# EAGLE design 6540Adapter_v2.0_th (EAGLE 7.7.0)
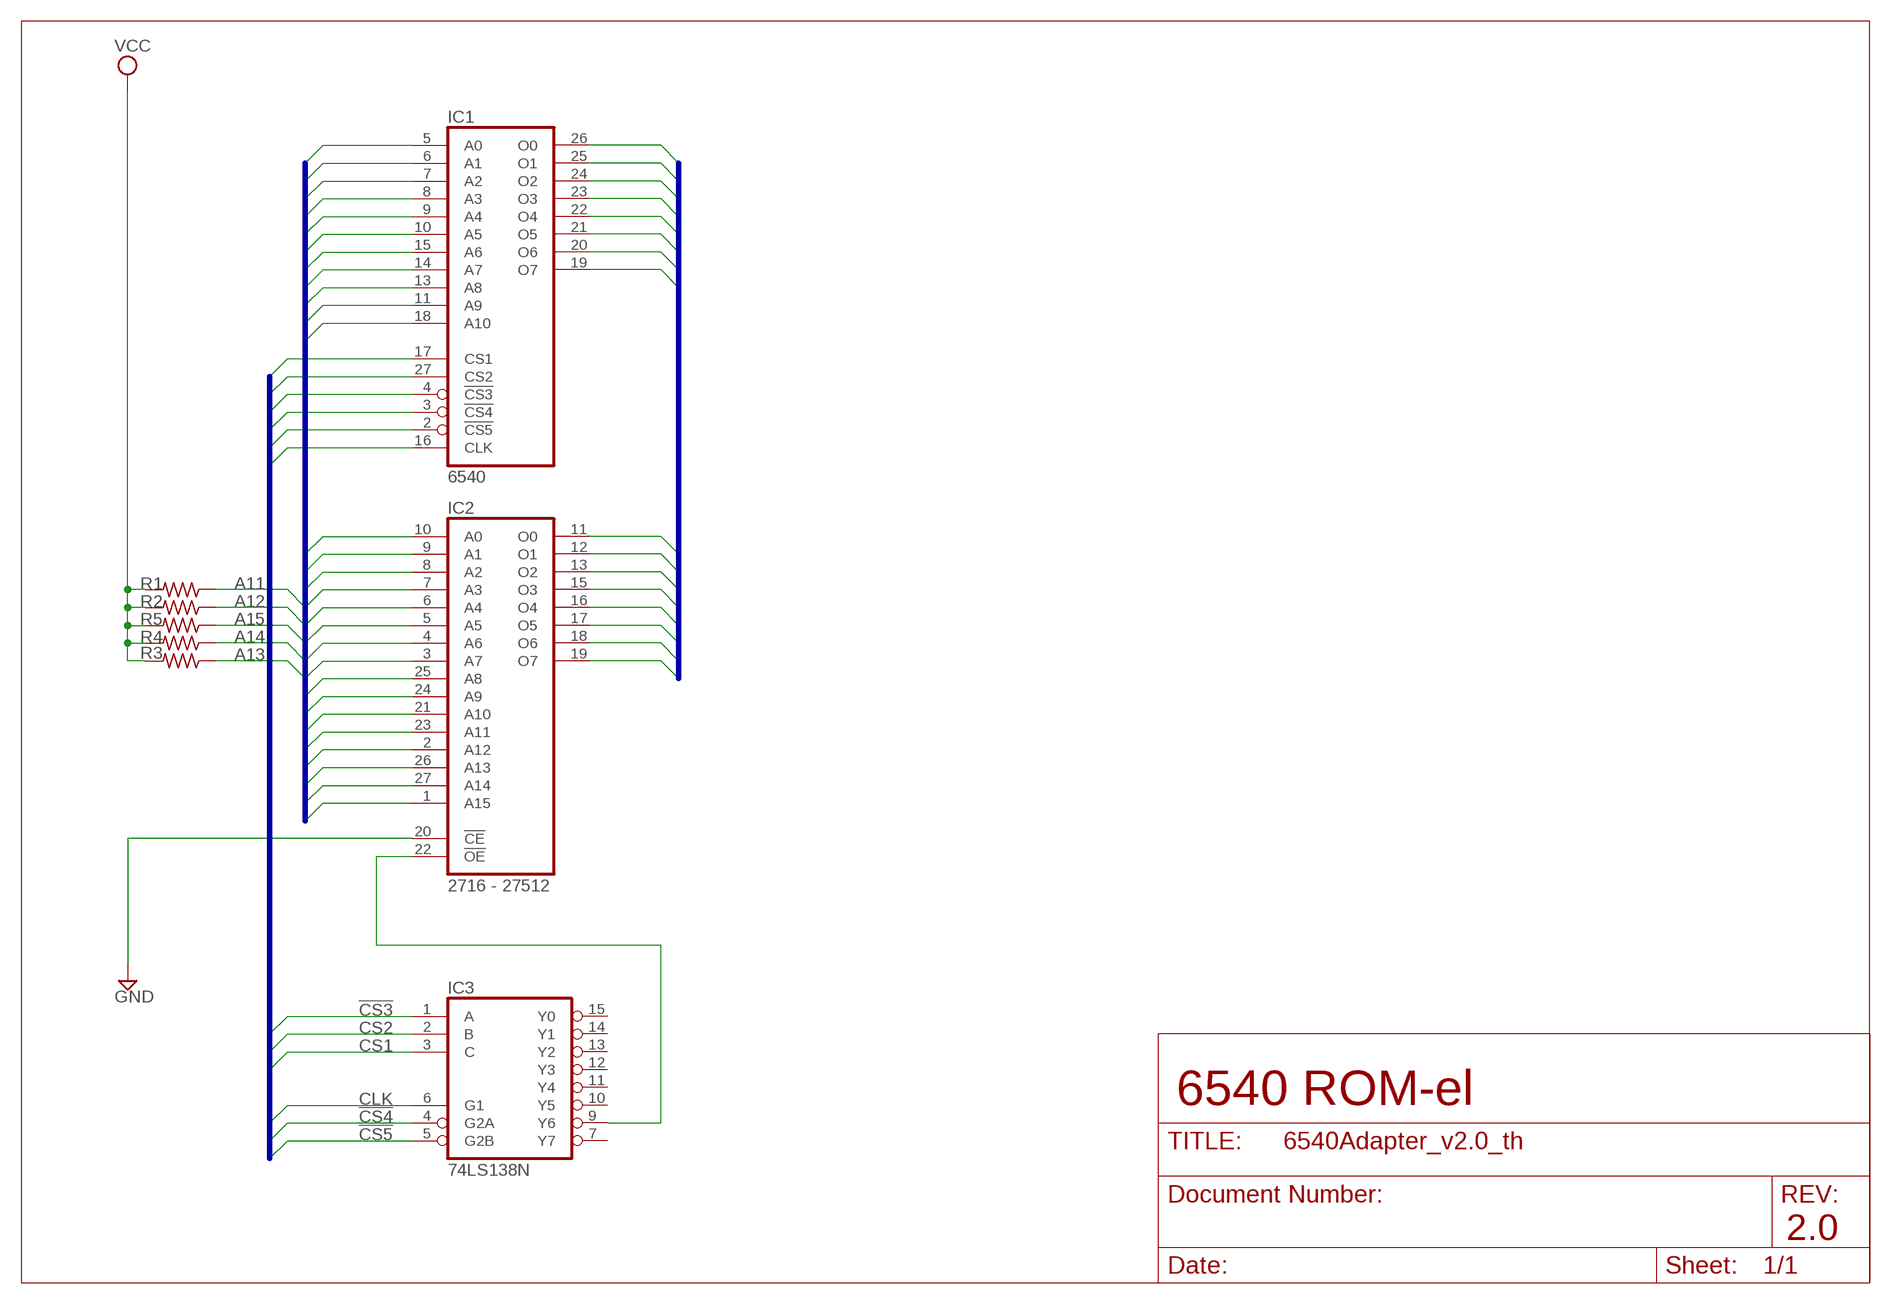
[diagram p0: schematic, sheet 1]

## Parts
IC1  6540  6540-RP  [DIL28-ROUNDPAD]
IC2  2716 - 27512  27512-NR  [DIL28-ROUNDPAD]
IC3  74LS138N  [DIL16]
R1  R-US_0204/5  [0204/5]
R2  R-US_0204/5  [0204/5]
R3  R-US_0204/5  [0204/5]
R4  R-US_0204/5  [0204/5]
R5  R-US_0204/5  [0204/5]

## Nets
!CS3: IC1.4(!CS3) IC3.1(A)
!CS4: IC1.3(!CS4) IC3.4(G2A)
!CS5: IC1.2(!CS5) IC3.5(G2B)
A0: IC1.5(A0) IC2.10(A0)
A1: IC1.6(A1) IC2.9(A1)
A2: IC1.7(A2) IC2.8(A2)
A3: IC1.8(A3) IC2.7(A3)
A4: IC1.9(A4) IC2.6(A4)
A5: IC1.10(A5) IC2.5(A5)
A6: IC1.15(A6) IC2.4(A6)
A7: IC1.14(A7) IC2.3(A7)
A8: IC1.13(A8) IC2.25(A8)
A9: IC1.11(A9) IC2.24(A9)
A10: IC1.18(A10) IC2.21(A10)
A11: IC2.23(A11) R1.1
A12: IC2.2(A12) R2.1
A13: IC2.26(A13) R3.1
A14: IC2.27(A14) R4.1
A15: IC2.1(A15) R5.1
CLK: IC1.16(CLK) IC3.6(G1)
CS1: IC1.17(CS1) IC3.3(C)
CS2: IC1.27(CS2) IC3.2(B)
D0: IC1.26(O0) IC2.11(O0)
D1: IC1.25(O1) IC2.12(O1)
D2: IC1.24(O2) IC2.13(O2)
D3: IC1.23(O3) IC2.15(O3)
D4: IC1.22(O4) IC2.16(O4)
D5: IC1.21(O5) IC2.17(O5)
D6: IC1.20(O6) IC2.18(O6)
D7: IC1.19(O7) IC2.19(O7)
GND: IC2.20(!CE)
N$1: IC2.22(!OE) IC3.9(Y6)
VCC: R1.2 R2.2 R3.2 R4.2 R5.2
Unconnected: IC3.7(Y7) IC3.10(Y5) IC3.11(Y4) IC3.12(Y3) IC3.13(Y2) IC3.14(Y1) IC3.15(Y0)

## Buses
A[0..15]
D[0..7]
CS1,CS2,!CS3,!CS4,!CS5,CLK

## Notes on the sheet
- 6540 ROM-el
- 2.0

## Power pins joined to a net without a drawn wire
GND: IC1.1(GND) IC2.14(GND) IC3.8(GND)
VCC: IC1.12(VCC) IC2.28(VCC) IC3.16(VCC)

## Library data of the parts
IC1 = commodore:6540
IC2 = 0RB_Memory:27512
IC3 = 74xx-us:74*138: 3-line to 8-line DECODER/DEMULTIPLEXER
R1-R5 = resistor:R-US_: RESISTOR, American symbol

## Board
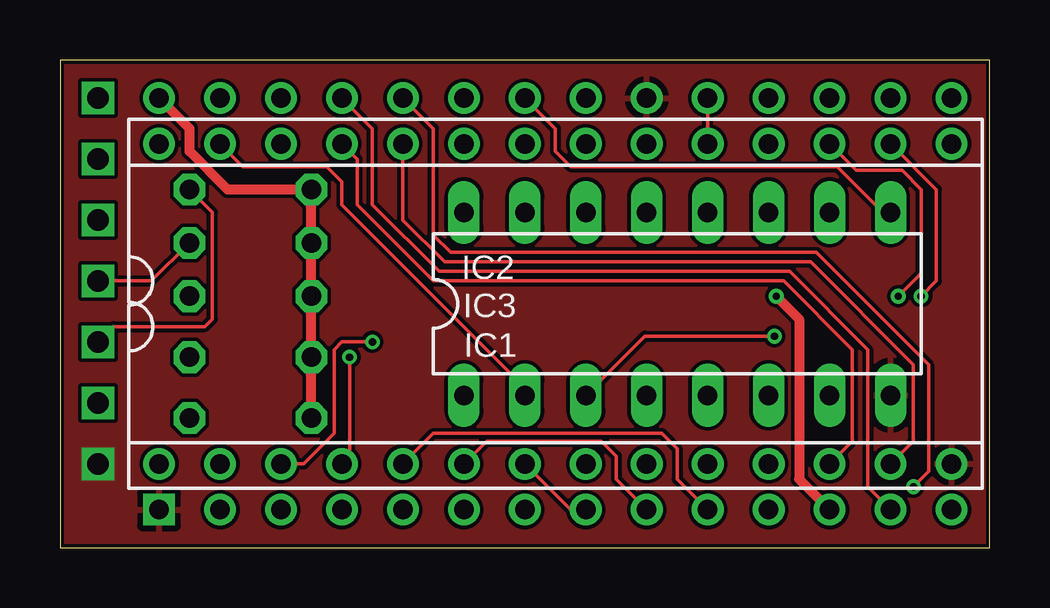
[diagram p1: board, top side]
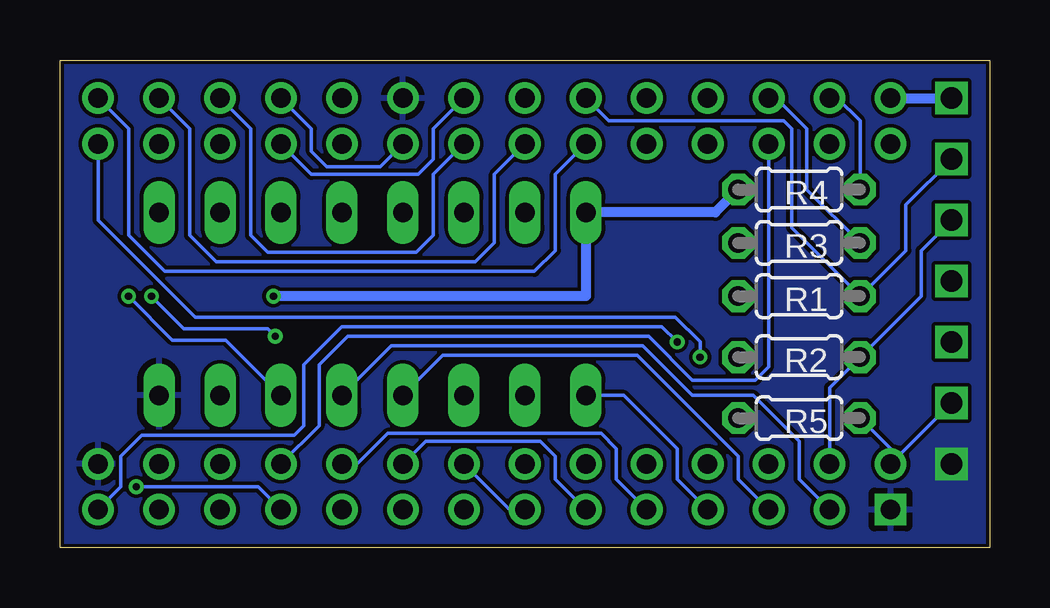
[diagram p2: board, bottom side, seen from below]

Size 38.73 x 20.32 mm. Coordinates in mm from the lower left corner, seen from the top.
Outline: 38.73,0 38.73,20.32 0,20.32 0,0 38.73,0
Copper layers (1*16): Top 0.035mm / dielectric 1.5mm / Bottom 0.035mm
Design rules "hackvana": minimum track width 6mil, minimum drill 0.3mm, track to track 6mil, track to pad 6mil, pad to pad 6mil, via to via 6mil, smd to smd 0mil, copper to edge 6mil, drill to drill 6mil, minimum pad ring 10mil, minimum via ring 6mil, stop-mask expansion 2mil, vias tented up to drill 100mil, thermal gap 10mil

### Footprints (pad centres in the part's own frame; a part is rotated, then mirrored left to right if it is on the bottom)
DIL28-ROUNDPAD = drill 0.813 square: 1 -16.51,-7.62 | drill 0.813: 2 -13.97,-7.62; 3 -11.43,-7.62; 4 -8.89,-7.62; 5 -6.35,-7.62; 6 -3.81,-7.62; 7 -1.27,-7.62; 8 1.27,-7.62; 9 3.81,-7.62; 10 6.35,-7.62; 11 8.89,-7.62; 12 11.43,-7.62; 13 13.97,-7.62; 14 16.51,-7.62; 15 16.51,7.62; 16 13.97,7.62; 17 11.43,7.62; 18 8.89,7.62; 19 6.35,7.62; 20 3.81,7.62; 21 1.27,7.62; 22 -1.27,7.62; 23 -3.81,7.62; 24 -6.35,7.62; 25 -8.89,7.62; 26 -11.43,7.62; 27 -13.97,7.62; 28 -16.51,7.62
DIL28-ROUNDPAD' = drill 0.813: 1 -16.51,-7.62; 2 -13.97,-7.62; 3 -11.43,-7.62; 4 -8.89,-7.62; 5 -6.35,-7.62; 6 -3.81,-7.62; 7 -1.27,-7.62; 8 1.27,-7.62; 9 3.81,-7.62; 10 6.35,-7.62; 11 8.89,-7.62; 12 11.43,-7.62; 13 13.97,-7.62; 14 16.51,-7.62; 15 16.51,7.62; 16 13.97,7.62; 17 11.43,7.62; 18 8.89,7.62; 19 6.35,7.62; 20 3.81,7.62; 21 1.27,7.62; 22 -1.27,7.62; 23 -3.81,7.62; 24 -6.35,7.62; 25 -8.89,7.62; 26 -11.43,7.62; 27 -13.97,7.62; 28 -16.51,7.62
DIL16 = drill 0.813 long: 1 -8.89,-3.81; 2 -6.35,-3.81; 3 -3.81,-3.81; 4 -1.27,-3.81; 5 1.27,-3.81; 6 3.81,-3.81; 7 6.35,-3.81; 8 8.89,-3.81; 9 8.89,3.81; 10 6.35,3.81; 11 3.81,3.81; 12 1.27,3.81; 13 -1.27,3.81; 14 -3.81,3.81; 15 -6.35,3.81; 16 -8.89,3.81
0204/5 = drill 0.813 octagon: 1 -2.54,0; 2 2.54,0

### Placement (x,y rotation side)
IC1  20.64,9.21 0 top
IC2  2716 - 27512  [DIL28-ROUNDPAD']  20.64,11.11 0 top
IC3  25.72,10.16 0 top
R1  7.94,10.48 180 bottom
R2  7.94,7.94 180 bottom
R3  7.94,12.7 180 bottom
R4  7.94,14.92 180 bottom
R5  7.94,5.4 180 bottom

### Tracks (layer width: path | path; a pad name or v marks a point on that pad's centre or on a via)
!CS3
  Bottom 0.152: IC1.4 13.02,2.86 13.02,4.13 15.24,6.35 IC3.1
!CS4
  Bottom 0.152: IC1.3 10.48,2.86 10.48,3.81 14.68,8.02 22.78,8.02 IC3.4
!CS5
  Bottom 0.152: IC1.2 7.94,2.86 7.94,4.45 9.84,6.35 12.38,6.35 14.45,8.41 19.84,8.41 24.92,8.41 IC3.5
A0
  Bottom 0.152: IC1.5 15.56,2.86 15.56,4.13 16.19,4.76 25.08,4.76 26.35,3.49 IC2.10
A1
  Bottom 0.152: IC1.6 18.1,2.86 18.1,3.81 18.73,4.45 23.5,4.45 IC2.9
A2
  Bottom 0.152: IC1.7 20,1.59 IC2.8
A3
  Top 0.152: IC1.8 21.27,1.59 IC2.7
A4
  Top 0.152: IC1.9 23.18,2.86 23.18,3.81 22.54,4.45 17.78,4.45 IC2.6
A5
  Top 0.152: IC1.10 25.72,2.86 25.72,4.13 25.08,4.76 15.56,4.76 IC2.5
A6  (via drill 0.3)
  Top 0.152: v12.06,7.94 12.06,3.81 IC2.4
  Bottom 0.152: IC1.15 37.15,13.65 33.1,9.6 13.1,9.6 12.06,8.57 v12.06,7.94
A7  (via drill 0.3)
  Top 0.152: IC2.3 10.16,3.49 11.43,4.76 11.43,8.26 11.75,8.57 v13.02,8.57
  Bottom 0.152: IC1.14 36.2,2.54 36.2,3.81 35.32,4.68 28.97,4.68 28.57,5.08 28.57,7.62 26.99,9.21 13.65,9.21 v13.02,8.57
A8
  Top 0.152: IC2.25 13.02,17.46 13.02,14.29 15.8,11.51 30.4,11.51 33.66,8.26 33.66,2.54 IC1.13
A9  (via drill 0.3)
  Top 0.152: IC2.24 15.56,17.46 15.56,13.02 16.27,12.3 31.51,12.3 36.2,7.62 36.2,3.17 v35.56,2.54
  Bottom 0.152: IC1.11 30.48,2.54 v35.56,2.54
A10
  Bottom 0.152: IC1.18 28.26,15.56 23.81,15.56 23.18,16.19 23.18,17.46 IC2.21
A11  (via drill 0.9)
  Bottom 0.152: IC2.23 15.88,17.78 8.57,17.78 8.26,17.46 8.26,13.34 R1.1 3.49,12.38 3.49,14.29 v1.59,16.19
A12  (via drill 0.9)
  Bottom 0.152: IC2.2 6.67,6.67 R2.1 2.86,10.48 2.86,12.38 v1.59,13.65
A13  (via drill 0.9)
  Top 0.152: R3.1 3.81,11.11 v1.59,11.11
  Bottom 0.152: R3.1 7.62,14.92 7.62,17.46 8.89,18.73 IC2.26
A14  (via drill 0.9)
  Top 0.152: v1.59,8.57 2.22,9.21 6.03,9.21 6.35,9.53 6.35,13.97 R4.1
  Bottom 0.152: IC2.27 6.35,18.73 5.4,17.78 5.4,17.62 5.4,15.08 R4.1
A15  (via drill 0.9)
  Bottom 0.152: v1.59,6.03 IC2.1 4.13,4.13 R5.1
CLK  (via drill 0.3)
  Top 0.152: IC1.16 36.51,14.92 36.51,11.11 v35.88,10.48
  Bottom 0.152: v35.88,10.48 34.05,8.65 31.83,8.65 IC3.6
CS1  (via drill 0.3)
  Top 0.152: IC1.17 33.18,15.72 35.08,15.72 35.88,14.92 35.88,11.43 v34.92,10.48 | v29.77,8.81 24.37,8.81 IC3.3
  Bottom 0.152: v34.92,10.48 33.58,9.13 30.08,9.13 v29.77,8.81
CS2
  Top 0.152: IC1.27 7.62,15.88 11.11,15.88 11.75,15.24 11.75,14.29 15.32,10.72 19.37,6.67 IC3.2
D0
  Bottom 0.152: IC2.11 27.94,5.08 27.94,7.62 26.75,8.81 14.21,8.81 12.38,6.99 9.76,6.99 9.21,7.54 IC1.26
D1
  Top 0.152: IC1.25 12.38,16.19 12.38,14.29 15.56,11.11 30.16,11.11 33.02,8.26 33.02,4.45 IC2.12
D2
  Top 0.152: IC1.24 14.29,13.65 16.03,11.91 31.27,11.91 35.56,7.62 35.56,4.45 IC2.13
D3
  Bottom 0.152: IC2.15 35.88,17.46 35.88,13.02 34.37,11.51 18.97,11.51 18.1,12.38 18.1,15.56 IC1.23
D4
  Bottom 0.152: IC2.16 33.34,17.46 33.34,13.02 32.23,11.91 21.43,11.91 20.64,12.7 20.64,15.56 IC1.22
D5
  Bottom 0.152: IC2.17 30.8,17.46 30.8,13.02 30.08,12.3 23.89,12.3 23.18,13.02 23.18,15.56 IC1.21
D6
  Bottom 0.152: IC2.18 28.26,17.46 28.26,16.51 27.62,15.88 25.4,15.88 IC1.20
D7
  Top 0.152: IC1.19 IC2.19
GND  (via drill 0.9)
  other vias: 1.59,3.49
  pour Top: 0,0 0,20.32 38.73,20.32 38.73,0
  pour Bottom: 0,0 0,20.32 38.73,20.32 38.73,0
N$1
  Top 0.152: IC2.22 20.64,17.46 20.64,16.51 21.27,15.88 32.38,15.88 33.97,14.29 34.29,14.29 IC3.9
VCC  (via drill 0.3, 0.9)
  Top 0.406: IC2.28 5.4,17.46 5.4,16.51 6.99,14.92 R4.2 R3.2 R1.2 R2.2 R5.2 | IC1.12 30.8,2.86 30.8,9.53 v29.84,10.48
  Bottom 0.406: v29.84,10.48 16.83,10.48 IC3.16 11.43,13.97 R4.2 | IC2.28 v1.59,18.73

### Text on the board
tValues: VCC | A11 | A12 | A13 | A14 | A15 | GND | 6540Adapter v2.0 | (c)2012 RETRO Innovations | go4retro.com